# Altium schematic sheet OTGW01_interfaces_rev1.SchDoc
size A4; SheetNumber: 2
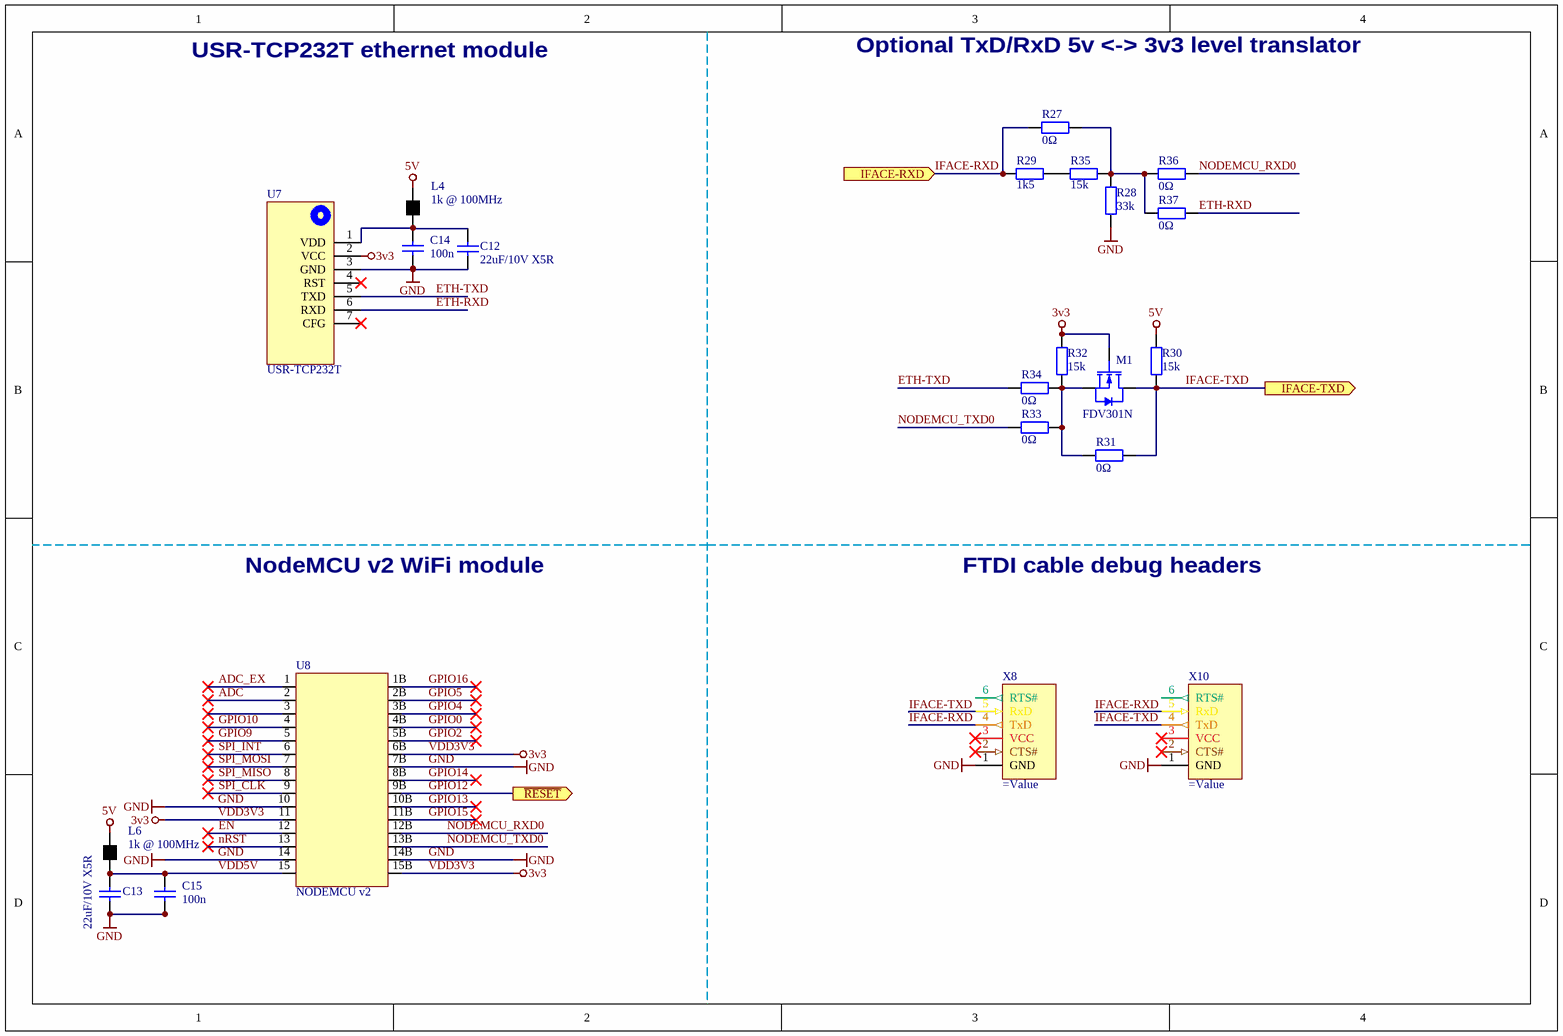
[diagram p0: OTGW01_interfaces_rev1.SchDoc]

## Parts
C12  22uF/10V X5R  [1210]
C13  22uF/10V X5R  [1210]
C14  100n  [0805]
C15  100n  [0805]
L4  1k @ 100MHz  [0805]
L6  1k @ 100MHz  [0805]
M1  FDV301N  [SOT23]
R27  0Ω  [0805]
R28  33k  [0805]
R29  1k5  [0805]
R30  15k  [0805]
R31  0Ω  [0805]
R32  15k  [0805]
R33  0Ω  [0805]
R34  0Ω  [0805]
R35  15k  [0805]
R36  0Ω  [0805]
R37  0Ω  [0805]
U7  USR-TCP232T  [USR-TCP232-T]
U8  NODEMCU v2  [NODEMCU]
X8  (no value)  [SIL-1x6-2.54]
X10  (no value)  [SIL-1x6-2.54]

## Ports
IFACE-RXD (in), IFACE-TXD (out), ~{RESET} (out)

## Nets
5V: L4.2(OUT) L6.2(OUT) R30.1
GND: C12.1 C13.1 C14.1 C15.1 R28.1 U7.3(GND) U8.7B U8.10 U8.14 U8.14B X8.1(GND) X10.1(GND)
VDD3V3: M1.1(G) R32.1 U7.2(VCC) U8.6B U8.11 U8.15B  [also labelled 3v3]
ADC: U8.2
ADC_EX: U8.1
EN: U8.12
ETH-RXD: R37.2 U7.6(RXD)
ETH-TXD: R34.1 U7.5(TXD)
GPIO0: U8.4B
GPIO2: U8.5B
GPIO4: U8.3B
GPIO5: U8.2B
GPIO9: U8.5
GPIO10: U8.4
GPIO12: U8.9B ; port ~{RESET}
GPIO13: U8.10B
GPIO14: U8.8B
GPIO15: U8.11B
GPIO16: U8.1B
IFACE-RXD: R27.1 R29.1 X8.4(TxD) X10.5(RxD) ; port IFACE-RXD
IFACE-TXD: M1.2(D) R30.2 R31.2 X8.5(RxD) X10.4(TxD) ; port IFACE-TXD
NODEMCU_RXD0: R36.2 U8.12B
NODEMCU_TXD0: R33.1 U8.13B
nRST: U8.13
SPI_CLK: U8.9
SPI_INT: U8.6
SPI_MISO: U8.8
SPI_MOSI: U8.7
VDD5V: C13.2 C15.2 L6.1(IN) U8.15
NetC12_2: C12.2 C14.2 L4.1(IN) U7.1(VDD)
NetM1_3: M1.3(S) R31.1 R32.2 R33.2 R34.2
NetR27_2: R27.2 R28.2 R35.2 R36.1 R37.1
NetR29_2: R29.2 R35.1

Not connected (* = marked no-connect by the designer): U7 4(RST)* 7(CFG)*; U8 3*; X8 2(CTS#)* 3(VCC)* 6(RTS#); X10 2(CTS#)* 3(VCC)* 6(RTS#)

## Notes on the sheet
- USR-TCP232T ethernet module
- Optional TxD/RxD 5v <-> 3v3 level translator
- NodeMCU v2 WiFi module
- FTDI cable debug headers

## Library data of the parts
C12-C15 = C: Capacitor Non Polarized; Supplier 1: Farnell
  C12 C13: Supplier Part Number 1: 2497183
  C14 C15: Supplier Part Number 1: 2470437
L4 L6 = Ferrite: Supplier 1: Farnell; Supplier Part Number 1: 1635737
M1 = FET_N: Supplier 1: Farnell; Supplier Part Number 1: 9845011
R27-R37 = R: Resistor; Supplier 1: Farnell
  R27 R31 R33 R34 R36 R37: Supplier Part Number 1: 9233750
  R28: Supplier Part Number 1: 9333053
  R29: Supplier Part Number 1: 9332600
  R30 R32 R35: Supplier Part Number 1: 9332618
U7 = USR-TCP232-T
U8 = NODEMCU
X8 X10 = TTL-232R: FTDI cable TTL232R footprint